# EAGLE design stir_plate1 (EAGLE 7.5.0)
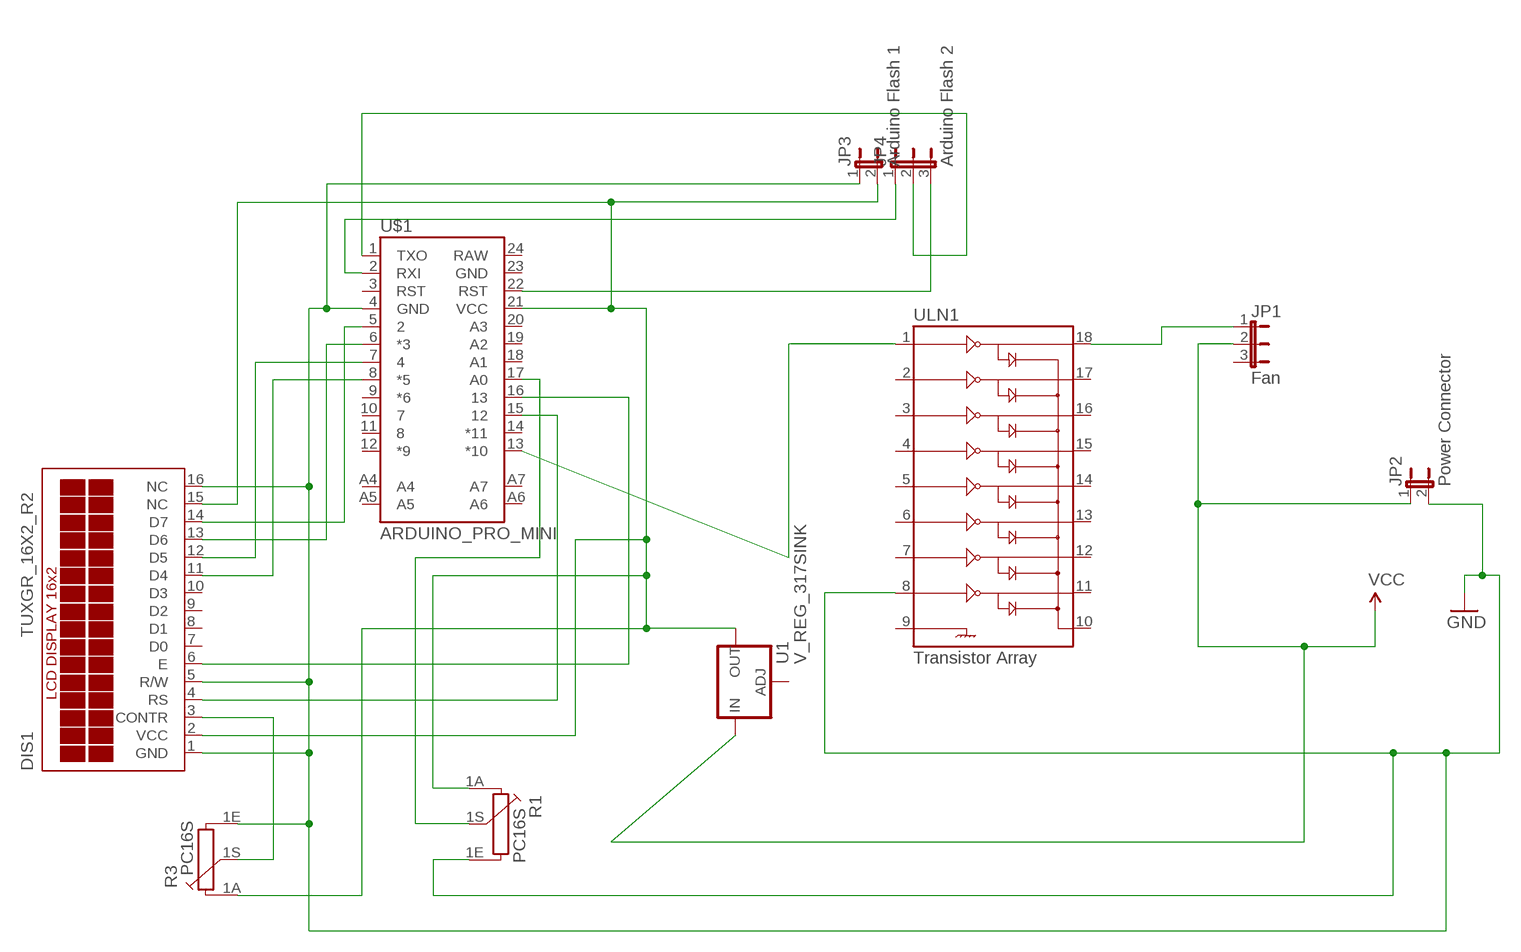
[diagram p0: schematic, sheet 1]

## Parts
DIS1  TUXGR_16X2_R2  [TUXGR_16X2_R2]
JP1  Fan  JP2E  [JP2]
JP2  Power Connector  JP1E  [JP1]
JP3  Arduino Flash 1  JP1E  [JP1]
JP4  Arduino Flash 2  JP2E  [JP2]
R1  PC16S  [PC16S]
R3  PC16S  [PC16S]
U1  V_REG_317SINK  [TO220-ADJ]
U$1  ARDUINO_PRO_MINI  [ARDUINO_PRO_MINI]
ULN1  Transistor Array  ULN2803DIP  [DIL18]

## Nets
GND: DIS1.1(GND) DIS1.5(R/W) DIS1.16(NC) JP2.2 JP3.1 R1.1E R3.1E U$1.4(GND) ULN1.8
N$1: U$1.13(*10) ULN1.1
N$2: JP1.1 ULN1.18
N$3: DIS1.3(CONTR) R3.1S
N$4: DIS1.11(D4) U$1.8(*5)
N$6: JP4.1 U$1.2(RXI)
N$7: DIS1.12(D5) U$1.7
N$8: DIS1.2(VCC) DIS1.15(NC) JP3.2 R1.1A R3.1A U1.OUT U$1.21(VCC)
N$9: DIS1.13(D6) U$1.6(*3)
N$10: DIS1.14(D7) U$1.5
N$11: DIS1.4(RS) U$1.15
N$12: R1.1S U$1.17(A0)
N$13: DIS1.6(E) U$1.16
N$14: JP4.2 U$1.1(TXO)
N$15: JP4.3 U$1.22(RST)
VCC: JP1.2 JP2.1 U1.IN
Unconnected: DIS1.7(D0) DIS1.8(D1) DIS1.9(D2) DIS1.10(D3) JP1.3 U1.ADJ U$1.3(RST) U$1.9(*6) U$1.10 U$1.11 U$1.12(*9) U$1.14(*11) U$1.18(A1) U$1.19(A2) U$1.20(A3) U$1.23(GND) U$1.24(RAW) U$1.A4 U$1.A5 U$1.A6 U$1.A7 ULN1.2 ULN1.3 ULN1.4 ULN1.5 ULN1.6 ULN1.7 ULN1.9 ULN1.10 ULN1.11 ULN1.12 ULN1.13 ULN1.14 ULN1.15 ULN1.16 ULN1.17

## Library data of the parts
DIS1 = display-lcd:TUXGR_16X2_R2: Tuxgraphics LCD display 16x2 characters reflective, without background light Source: tuxgr_12x2_r2.pdf; OC_FARNELL: unknown; OC_NEWARK: unknown
JP1 JP4 = jumper:JP2E: JUMPER
JP2 JP3 = jumper:JP1E: JUMPER
R1 R3 = piher:PC16S: POTENTIOMETER single carbon potentiometer, 16 mm, S3ROH; OC_FARNELL: 4452940; OC_NEWARK: unknown
U1 = SparkFun-PowerIC:V_REG_317: Voltage Regulator Standard LM317 adjustable voltage regulator. AOI (Adjust Output Input). Google 'LM317 Calculator' for easy to use app to get the two resistor values needed. 240/720 for 5V output. 240/390 for 3.3V output. Spark Fun Electronics SKU : COM-00527
U$1 = SparkFun-Boards:ARDUINO_PRO_MINI
ULN1 = SparkFun-PowerIC:ULN2803: Darlington Driver ULN2803 Darlington array. 500mA max per channel, 8-channel package. Spark Fun Electronics SKU : COM-00312

## Net classes
0 default: clearance 0.205 mm

## Board
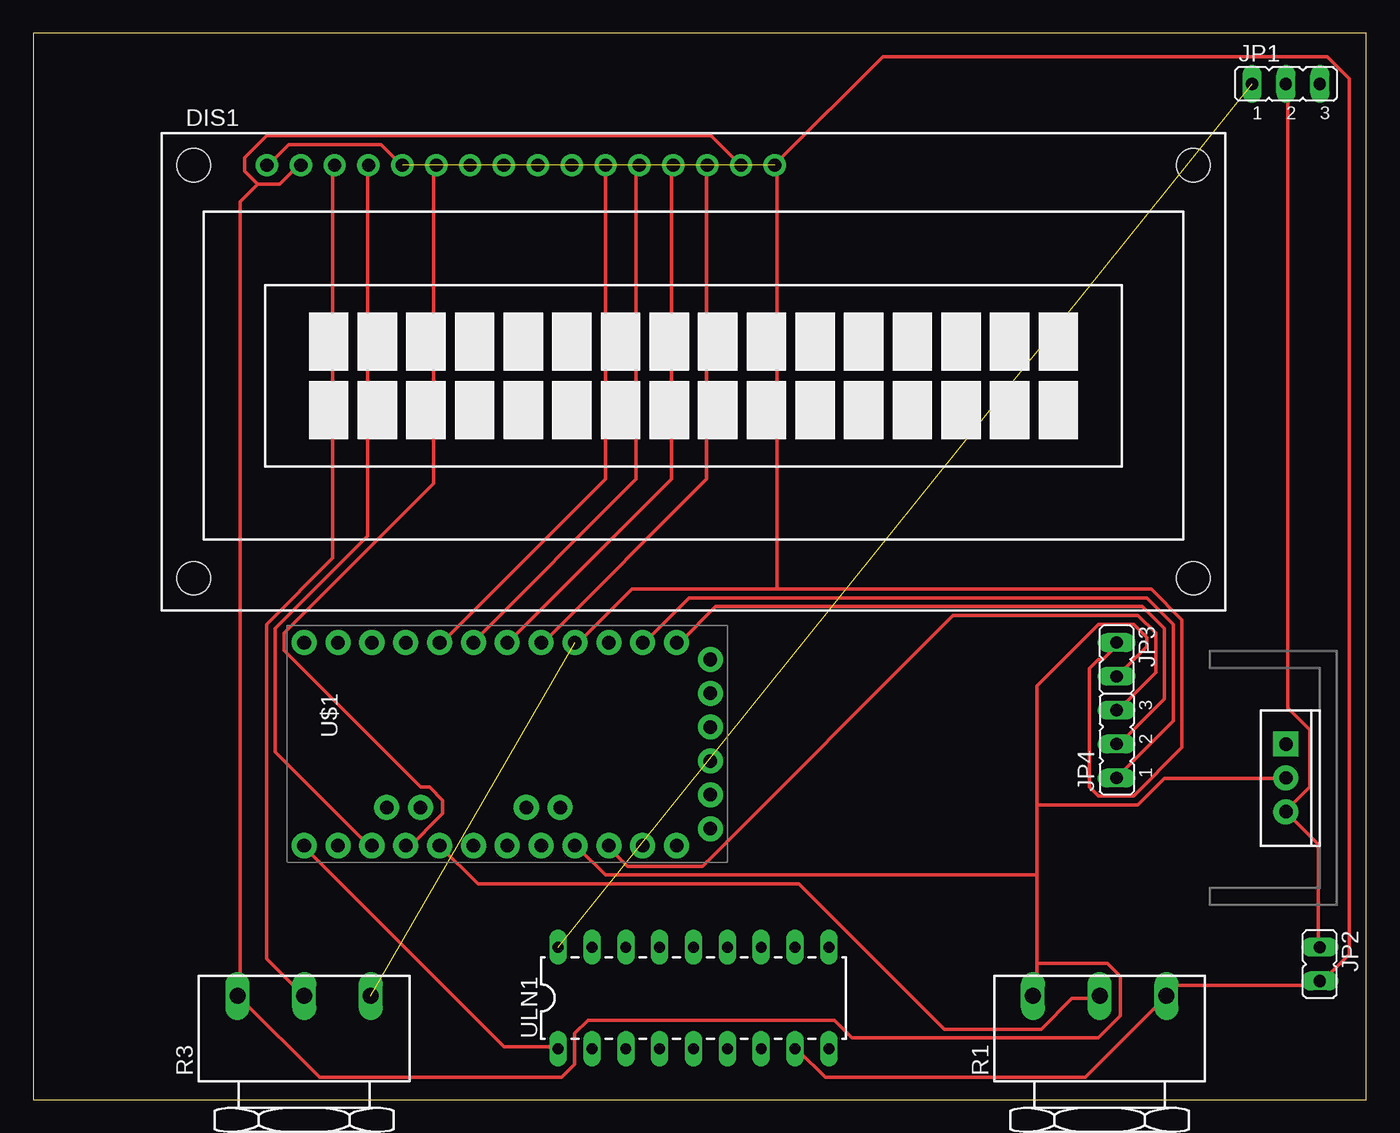
[diagram p1: board, top side]

Size 100 x 80 mm. Coordinates in mm from the lower left corner, seen from the top.
Outline: 0,0 100,0 100,80 0,80 0,0
Copper layers (1*16): Top 0.035mm / dielectric 1.5mm / Bottom 0.035mm
Design rules "default *": minimum track width 10mil, minimum drill 24mil, track to track 16mil, track to pad 16mil, pad to pad 8mil, via to via 8mil, smd to smd 8mil, copper to edge 40mil, drill to drill 8mil, minimum pad ring 10mil, minimum via ring 8mil, stop-mask expansion 4mil, vias tented up to drill 0mil, thermal gap 10mil

### Footprints (pad centres in the part's own frame; a part is rotated, then mirrored left to right if it is on the bottom)
TUXGR_16X2_R2 = drill 1 pad 1.676: 1 -32,15.5; 2 -29.46,15.5; 3 -26.92,15.5; 4 -24.38,15.5; 5 -21.84,15.5; 6 -19.3,15.5; 7 -16.76,15.5; 8 -14.22,15.5; 9 -11.68,15.5; 10 -9.14,15.5; 11 -6.6,15.5; 12 -4.06,15.5; 13 -1.52,15.5; 14 1.02,15.5; 15 3.56,15.5; 16 6.1,15.5 | hole 2.5: -37.5,-15.5; 37.5,-15.5; -37.5,15.5; 37.5,15.5
JP2 = drill 0.914 long: 1 -2.54,0; 2 0,0; 3 2.54,0
JP1 = drill 0.914 long: 1 0,-1.27; 2 0,1.27
PC16S = drill 1.2 long: 1A -5,6.5; 1E 5,6.5; 1S 0,6.5
TO220-ADJ = drill 1 pad 1.88 square: ADJ -2.54,0 | drill 1 pad 1.88: IN 2.54,0; OUT 0,0
ARDUINO_PRO_MINI = drill 1.016 pad 1.88: 1 -7.62,12.7; 2 -7.62,10.16; 3 -7.62,7.62; 4 -7.62,5.08; 5 -7.62,2.54; 6 -7.62,0; 7 -7.62,-2.54; 8 -7.62,-5.08; 9 -7.62,-7.62; 10 -7.62,-10.16; 11 -7.62,-12.7; 12 -7.62,-15.24; 13 7.62,-15.24; 14 7.62,-12.7; 15 7.62,-10.16; 16 7.62,-7.62; 17 7.62,-5.08; 18 7.62,-2.54; 19 7.62,0; 20 7.62,2.54; 21 7.62,5.08; 22 7.62,7.62; 23 7.62,10.16; 24 7.62,12.7; A4 4.763,1.429; A5 4.763,3.969; A6 4.763,-9.049; A7 4.763,-6.509; BLK -6.35,15.24; GND -3.81,15.24; GRN 6.35,15.24; RXI 1.27,15.24; TXO 3.81,15.24; VCC -1.27,15.24
DIL18 = drill 0.813 long: 1 -10.16,-3.81; 2 -7.62,-3.81; 3 -5.08,-3.81; 4 -2.54,-3.81; 5 0,-3.81; 6 2.54,-3.81; 7 5.08,-3.81; 8 7.62,-3.81; 9 10.16,-3.81; 10 10.16,3.81; 11 7.62,3.81; 12 5.08,3.81; 13 2.54,3.81; 14 0,3.81; 15 -2.54,3.81; 16 -5.08,3.81; 17 -7.62,3.81; 18 -10.16,3.81

### Placement (x,y rotation side)
DIS1  49.53,54.61 0 top
JP1  93.98,76.2 0 top
JP2  96.52,10.16 180 top
JP3  81.28,33.02 180 top
JP4  81.28,26.67 90 top
R1  80.01,1.27 0 top
R3  20.32,1.27 0 top
U1  93.98,24.13 270 top
U$1  35.56,26.67 270 top
ULN1  49.53,7.62 0 top

### Tracks (layer width: path | path; a pad name or v marks a point on that pad's centre or on a via)
GND  (2 unrouted)
  Top 0.254: ULN1.8 57.45,3.63 59.44,1.65 78.92,1.65 84.86,7.59 R1.1E 85.19,7.92 85.85,8.59 96.42,8.59 JP2.2 96.75,8.91 98.73,10.9 98.73,76.61 97.08,78.26 63.73,78.26 55.8,70.33 DIS1.16 55.8,70 55.8,38.3 | 55.8,38.3 44.91,38.3 40.95,34.34 U$1.4 | 55.8,38.3 83.87,38.3 86.18,35.99 86.18,26.42 82.55,22.78 79.91,22.78 79.25,23.44 79.25,32.36 79.91,33.02 80.24,33.02 81.23,34.01 JP3.1 | DIS1.1 17.83,70.33 19.15,71.65 26.09,71.65 27.41,70.33 DIS1.5
N$1
  Top 0.254: ULN1.1 39.29,3.96 35.33,3.96 20.47,18.82 U$1.13
N$2  (1 unrouted)
N$3
  Top 0.254: DIS1.3 22.45,70 22.45,40.62 17.5,35.66 17.5,10.57 20.14,7.92 R3.1S
N$4
  Top 0.254: DIS1.11 42.93,70 42.93,46.56 30.71,34.34 U$1.8
N$6
  Top 0.254: JP4.1 81.56,24.43 85.52,28.4 85.52,35.66 83.54,37.64 49.2,37.64 45.9,34.34 U$1.2
N$7
  Top 0.254: DIS1.12 45.24,70 45.24,46.56 33.02,34.34 U$1.7
N$8
  Top 0.254: JP3.2 83.54,34.01 83.54,34.67 82.55,35.66 79.91,35.66 75.29,31.04 75.29,22.12 | 75.29,10.24 75.29,7.92 R1.1A | 75.29,10.24 75.29,16.84 | 75.29,16.84 75.29,22.12 | 75.29,16.84 42.93,16.84 40.95,18.82 U$1.21 | 75.29,22.12 82.88,22.12 84.86,24.11 93.78,24.11 U1.OUT | 16.84,68.68 18.49,68.68 19.81,70 DIS1.2 | 16.84,68.68 15.85,69.67 15.85,70.66 17.5,72.31 50.85,72.31 52.83,70.33 DIS1.15 | 16.84,68.68 15.52,67.36 15.52,7.92 R3.1A 15.52,7.59 21.46,1.65 39.62,1.65 40.62,2.64 40.62,4.95 41.6,5.94 60.1,5.94 61.42,4.62 79.91,4.62 81.56,6.27 81.56,9.25 80.57,10.24 75.29,10.24
N$9
  Top 0.254: DIS1.13 47.88,70 47.88,46.56 35.66,34.34 U$1.6
N$10
  Top 0.254: DIS1.14 50.52,70 50.52,46.56 38.3,34.34 U$1.5
N$11
  Top 0.254: DIS1.4 25.09,70 25.09,42.27 18.16,35.33 18.16,26.09 25.09,19.15 U$1.15
N$12
  Top 0.254: U$1.17 33.35,16.18 57.45,16.18 68.35,5.28 75.62,5.28 77.93,7.59 79.91,7.59 R1.1S
N$13
  Top 0.254: DIS1.6 30.05,70 30.05,46.23 18.82,35 18.82,33.68 29.06,23.44 29.72,23.44 30.71,22.45 30.71,21.46 28.07,18.82 U$1.16
N$14
  Top 0.254: JP4.2 81.56,26.75 84.86,30.05 84.86,35.33 83.21,36.98 51.18,36.98 48.54,34.34 U$1.1
N$15
  Top 0.254: JP4.3 81.56,29.39 84.2,32.03 84.2,35 82.88,36.32 69.01,36.32 50.19,17.5 44.58,17.5 43.26,18.82 U$1.22
VCC
  Top 0.254: JP1.2 94.11,75.95 94.11,29.39 95.76,27.74 95.76,23.44 94.11,21.79 U1.IN 96.42,19.15 96.42,11.56 JP2.1